# Altium schematic sheet 09.SchDoc
size 297 x 209 mm
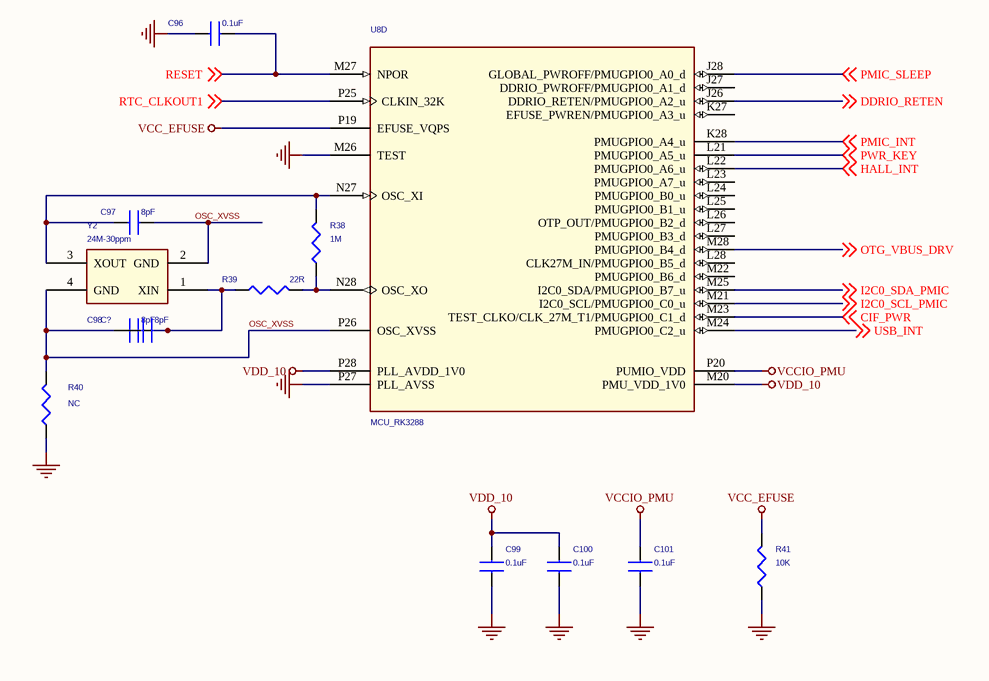
[diagram p0: 09.SchDoc]

## Parts
C96  0.1uF  [C0603]
C97  8pF  [C0603]
C98  8pF  [C0603]
C99  0.1uF  [C0603]
C100  0.1uF  [C0603]
C101  0.1uF  [C0603]
C?  8pF  [C0603]
R38  1M  [r0402]
R39  22R  [r0402]
R40  NC  [r0402]
R41  10K  [r0402]
U8  MCU_RK3288  [BGA453-19X19]  (part D of 24)
Y2  24M-30ppm  [CRY-3225]

## Nets
GND: C96.1 C99.1 C100.1 C101.1 R40.1 R41.1 U8.M26(TEST) U8.P27(PLL_AVSS)
VCC_EFUSE: R41.2 U8.P19(EFUSE_VQPS)
VCCIO_PMU: C101.2 U8.P20(PUMIO_VDD)
VDD_10: C99.2 C100.2 U8.M20(PMU_VDD_1V0) U8.P28(PLL_AVDD_1V0)
CIF_PWR: U8.M23(TEST_CLKO/CLK_27M_T1/PMUGPIO0_C1_d) ; off-sheet CIF_PWR
DDRIO_RETEN: U8.J26(DDRIO_RETEN/PMUGPIO0_A2_u) ; off-sheet DDRIO_RETEN
HALL_INT: U8.L22(PMUGPIO0_A6_u) ; off-sheet HALL_INT
I2C0_SCL_PMIC: U8.M21(I2C0_SCL/PMUGPIO0_C0_u) ; off-sheet I2C0_SCL_PMIC
I2C0_SDA_PMIC: U8.M25(I2C0_SDA/PMUGPIO0_B7_u) ; off-sheet I2C0_SDA_PMIC
OSC_XVSS: C97.2 C98.2 R40.2 U8.P26(OSC_XVSS) Y2.2(GND) Y2.4(GND)
OTG_VBUS_DRV: U8.M28(PMUGPIO0_B4_d) ; off-sheet OTG_VBUS_DRV
PMIC_INT: U8.K28(PMUGPIO0_A4_u) ; off-sheet PMIC_INT
PMIC_SLEEP: U8.J28(GLOBAL_PWROFF/PMUGPIO0_A0_d) ; off-sheet PMIC_SLEEP
PWR_KEY: U8.L21(PMUGPIO0_A5_u) ; off-sheet PWR_KEY
RESET: C96.2 U8.M27(NPOR) ; off-sheet RESET
RTC_CLKOUT1: U8.P25(CLKIN_32K) ; off-sheet RTC_CLKOUT1
USB_INT: U8.M24(PMUGPIO0_C2_u) ; off-sheet USB_INT
NetC97_1: C97.1 R38.2 U8.N27(OSC_XI) Y2.3(XOUT)
NetC98_1: C98.1 C?.1 R39.1 Y2.1(XIN)
NetR38_1: R38.1 R39.2 U8.N28(OSC_XO)

Not connected (* = marked no-connect by the designer): C? 2; U8 J27(DDRIO_PWROFF/PMUGPIO0_A1_d) K27(EFUSE_PWREN/PMUGPIO0_A3_u) L23(PMUGPIO0_A7_u) L24(PMUGPIO0_B0_u) L25(PMUGPIO0_B1_u) L26(OTP_OUT/PMUGPIO0_B2_d) L27(PMUGPIO0_B3_d) L28(CLK27M_IN/PMUGPIO0_B5_d) M22(PMUGPIO0_B6_d)

## Library data of the parts
C96 C101 = CAP NP_Dup3: 贴片电容; ROOM: USB+5V; MARK: 106
C97 C98 C? = CAP NP_Dup3
C99 C100 = CAP NP_Dup3: 贴片电容; MARK: 106; ROOM: USB+5V
R38-R40 = RESISTOR_1_Dup2
R41 = RESISTOR_0_Dup3: RES,thick film,100KOhm,+/-5%,1/16W,SMD0402; MARK: 51K
U8 = MCU_RK3288_3
Y2 = CRYSTAL-4_1